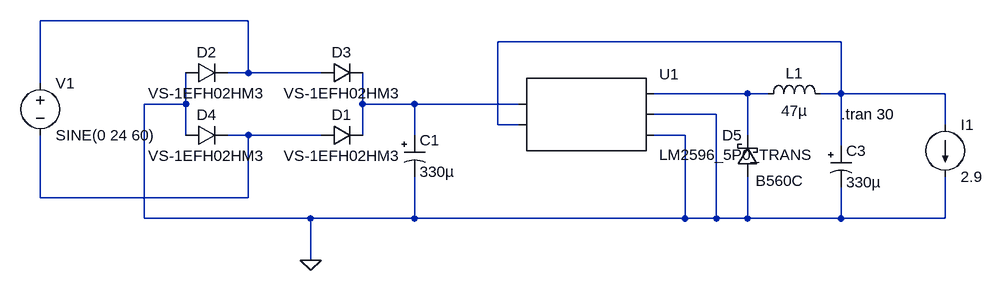
[diagram p0: schematic 24AC.asc]
24AC.asc, the LTspice schematic file:
Version 4
SHEET 1 2044 680
WIRE 384 32 64 32
WIRE 1296 64 768 64
WIRE 384 112 384 32
WIRE 384 112 352 112
WIRE 496 112 384 112
WIRE 64 128 64 32
WIRE 1152 144 1008 144
WIRE 1184 144 1152 144
WIRE 1296 144 1296 64
WIRE 1296 144 1264 144
WIRE 1456 144 1296 144
WIRE 288 160 288 112
WIRE 288 160 224 160
WIRE 560 160 560 112
WIRE 640 160 560 160
WIRE 800 160 640 160
WIRE 1104 176 1008 176
WIRE 768 192 768 64
WIRE 800 192 768 192
WIRE 1456 192 1456 144
WIRE 288 208 288 160
WIRE 384 208 352 208
WIRE 496 208 384 208
WIRE 560 208 560 160
WIRE 640 208 640 160
WIRE 1056 208 1008 208
WIRE 1152 208 1152 144
WIRE 1296 224 1296 144
WIRE 64 304 64 208
WIRE 384 304 384 208
WIRE 384 304 64 304
WIRE 224 336 224 160
WIRE 480 336 224 336
WIRE 640 336 640 272
WIRE 640 336 480 336
WIRE 1056 336 1056 208
WIRE 1056 336 640 336
WIRE 1104 336 1104 176
WIRE 1104 336 1056 336
WIRE 1152 336 1152 272
WIRE 1152 336 1104 336
WIRE 1296 336 1296 288
WIRE 1296 336 1152 336
WIRE 1456 336 1456 272
WIRE 1456 336 1296 336
WIRE 480 400 480 336
FLAG 480 400 0
SYMBOL voltage 64 112 R0
WINDOW 123 24 124 Left 2
WINDOW 39 0 0 Left 0
SYMATTR InstName V1
SYMATTR Value SINE(0 24 60)
SYMBOL diode 496 224 R270
WINDOW 0 32 32 VTop 2
WINDOW 3 0 32 VBottom 2
SYMATTR InstName D1
SYMATTR Value VS-1EFH02HM3
SYMBOL diode 288 128 R270
WINDOW 0 32 32 VTop 2
WINDOW 3 0 32 VBottom 2
SYMATTR InstName D2
SYMATTR Value VS-1EFH02HM3
SYMBOL diode 496 128 R270
WINDOW 0 32 32 VTop 2
WINDOW 3 0 32 VBottom 2
SYMATTR InstName D3
SYMATTR Value VS-1EFH02HM3
SYMBOL diode 288 224 R270
WINDOW 0 32 32 VTop 2
WINDOW 3 0 32 VBottom 2
SYMATTR InstName D4
SYMATTR Value VS-1EFH02HM3
SYMBOL polcap 624 208 R0
WINDOW 3 24 56 Left 2
SYMATTR Value 330µ
SYMATTR InstName C1
SYMATTR SpiceLine V=35 Irms=1.69 Rser=0.035 Lser=0
SYMATTR Description Capacitor
SYMATTR Type cap
SYMBOL ind 1168 160 R270
WINDOW 0 32 56 VTop 2
WINDOW 3 5 56 VBottom 2
SYMATTR InstName L1
SYMATTR Value 47µ
SYMATTR SpiceLine Ipk=8.7 Rser=0.042 Rpar=0 Cpar=0
SYMBOL polcap 1280 224 R0
WINDOW 3 24 56 Left 2
SYMATTR Value 330µ
SYMATTR InstName C3
SYMATTR SpiceLine V=10 Irms=445m Rser=0.17 Lser=0 mfg="Panasonic" pn="ECA1AFQ331" type="Al electrolytic"
SYMATTR Description Capacitor
SYMATTR Type cap
SYMBOL AutoGenerated\\LM2596_5P0_TRANS 896 176 R0
SYMATTR InstName U1
SYMBOL schottky 1168 272 R180
WINDOW 0 24 64 Left 2
WINDOW 3 -70 -6 Left 2
SYMATTR InstName D5
SYMATTR Value B560C
SYMATTR Description Diode
SYMATTR Type diode
SYMBOL current 1456 192 R0
WINDOW 123 0 0 Left 0
WINDOW 39 0 0 Left 0
SYMATTR InstName I1
SYMATTR Value 2.9
TEXT 1296 176 Left 2 !.tran 30

The netlist it stands for:
* 24AC.asc
V1 N001 N005 SINE(0 24 60)
D1 N005 N004 VS-1EFH02HM3
D2 0 N001 VS-1EFH02HM3
D3 N001 N004 VS-1EFH02HM3
D4 0 N005 VS-1EFH02HM3
C1 N004 0 330µ V=35 Irms=1.69 Rser=0.035 Lser=0
L1 N003 N002 47µ Ipk=8.7 Rser=0.042 Rpar=0 Cpar=0
C3 N002 0 330µ V=10 Irms=445m Rser=0.17 Lser=0 mfg="Panasonic" pn="ECA1AFQ331" type="Al electrolytic"
* U1: LM2596_5P0_TRANS (symbol AutoGenerated\LM2596_5P0_TRANS not available, pins judged from their places): pin1=N004 pin2=N002 pin3=N003 pin4=0 pin5=0
D5 0 N003 B560C
I1 N002 0 2.9
.model D D
.lib standard.dio
.tran 30
.backanno
.end